# EAGLE design controller (EAGLE 6.5.0)
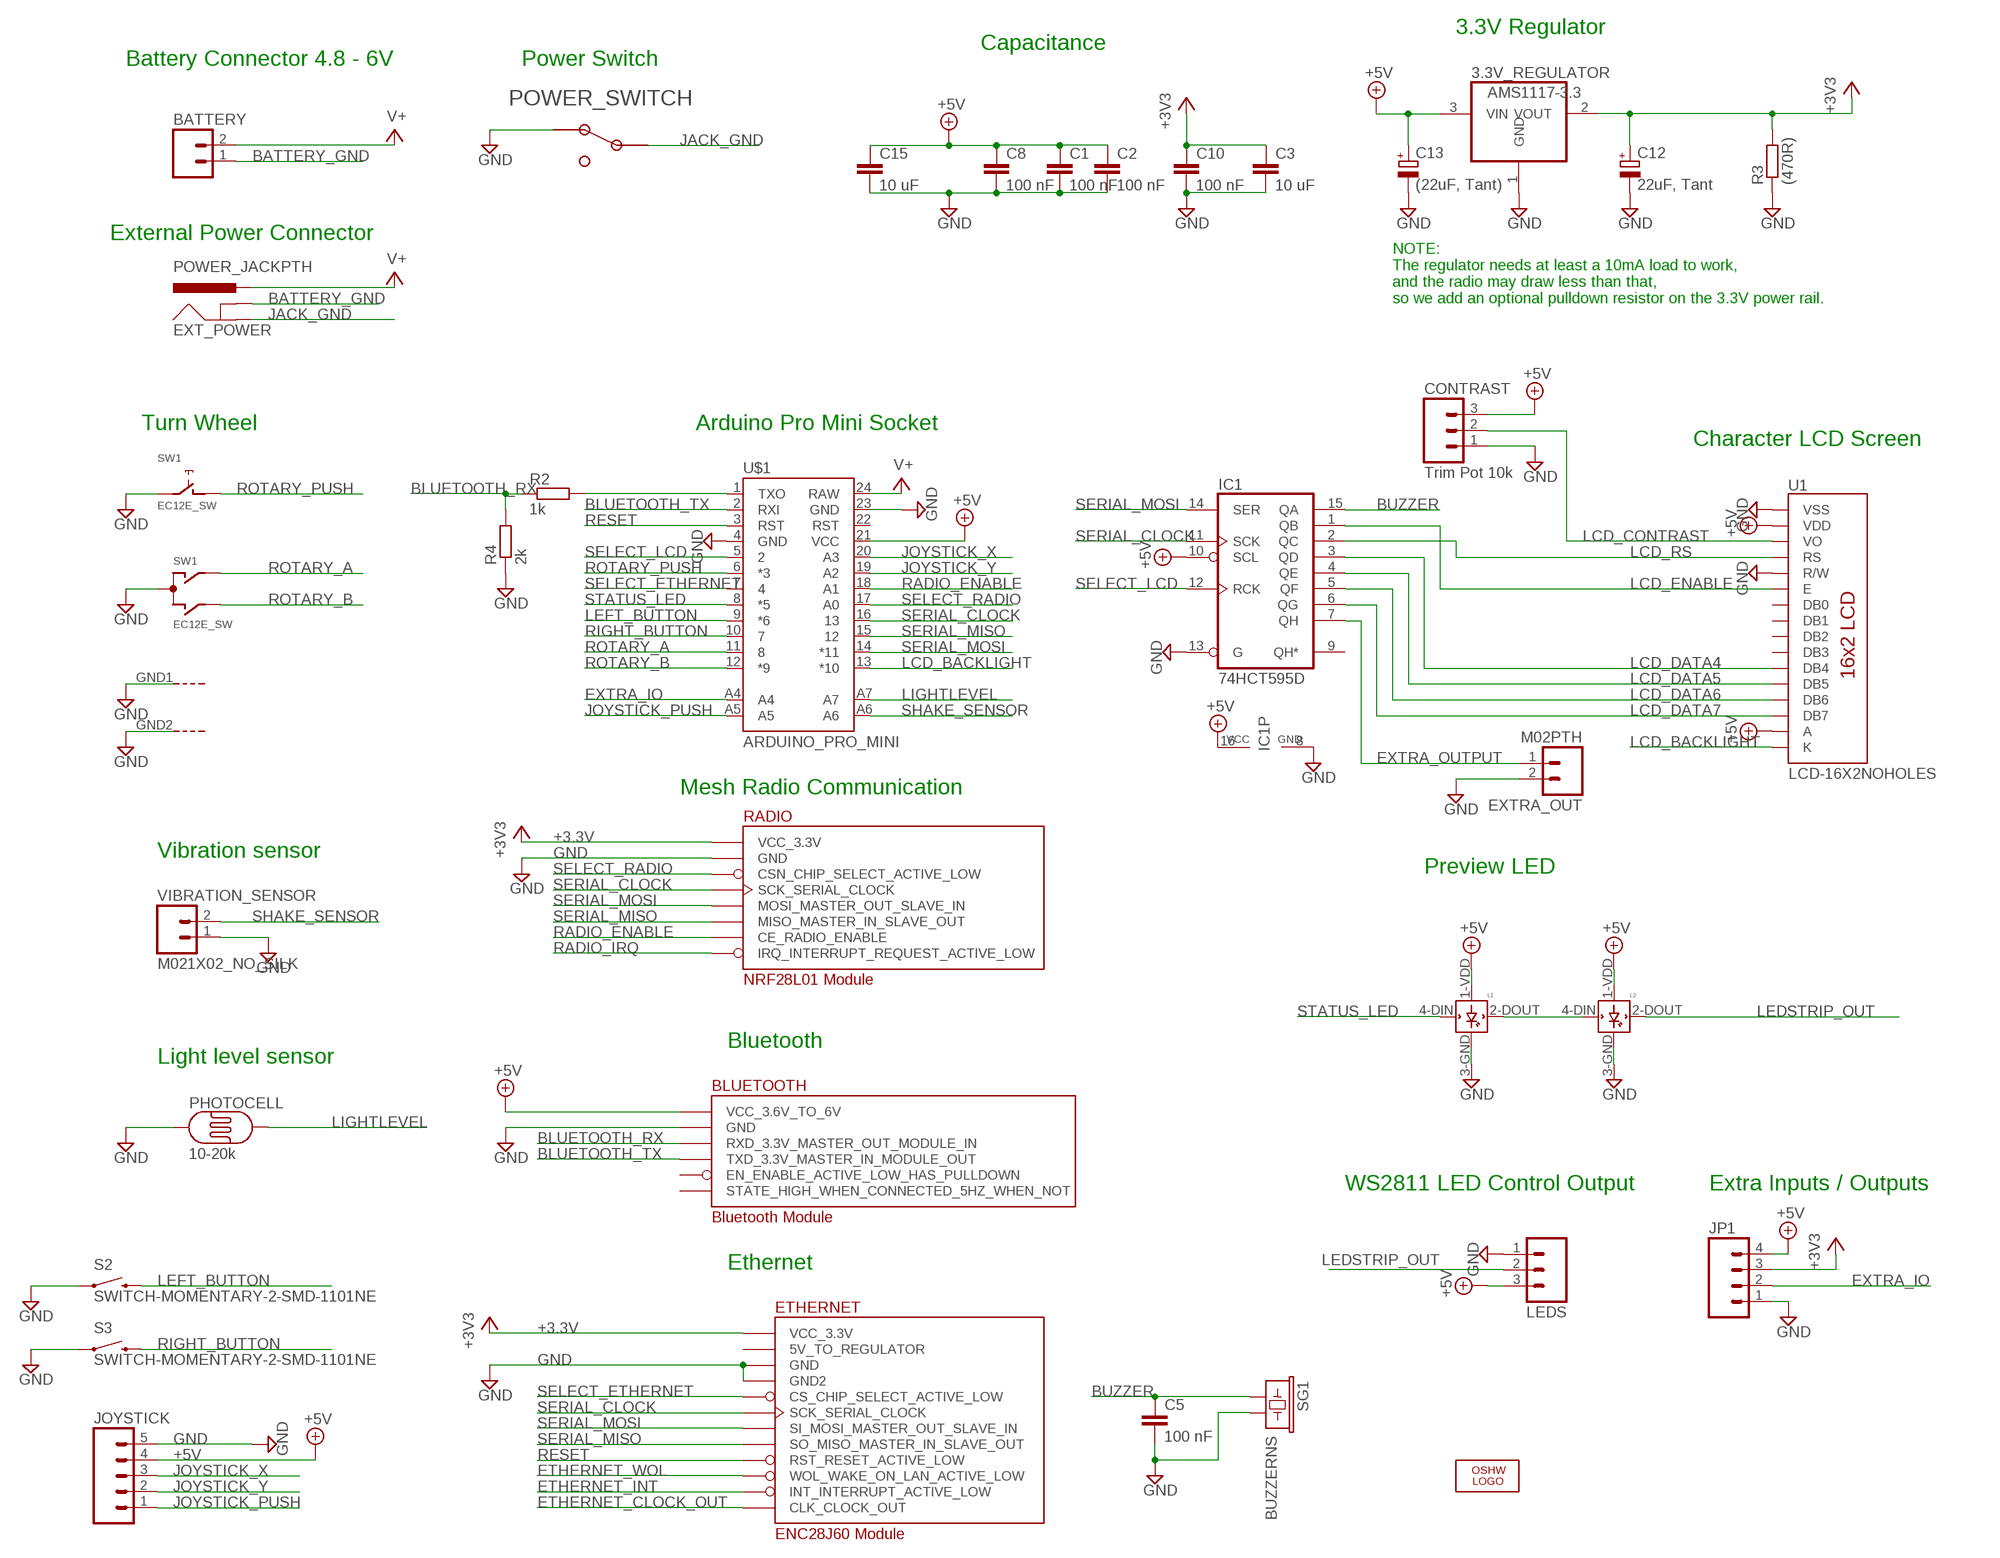
[diagram p0: schematic, sheet 1]

## Parts
3.3V_REGULATOR  AMS1117-3.3  REG1117  [SOT223]
BATTERY  M02LOCK_LONGPADS  [1X02_LOCK_LONGPADS]
BLUETOOTH  Bluetooth Module  BLUETOOTH_MODULE  [BLUETOOTH_MODULE]
C1  100 nF  C-EUC0805  [C0805]
C2  100 nF  C-EUC0805  [C0805]
C3  10 uF  C-EUC0805K  [C0805K]
C5  100 nF  C-EUC0805  [C0805]
C8  100 nF  C-EUC0805  [C0805]
C10  100 nF  C-EUC0805  [C0805]
C12  22uF, Tant  CPOL-EUSMCA  [SMC_A]
C13  (22uF, Tant)  CPOL-EUSMCA  [SMC_A]
C15  10 uF  C-EUC0805K  [C0805K]
CONTRAST  Trim Pot 10k  M031X03_NO_SILK  [1X03_NO_SILK]
ETHERNET  ENC28J60 Module  ETHERNET_ENC28J60_MODULE  [ETHERNET_ENC28J60_MODULE]
EXT_POWER  POWER_JACKPTH  [POWER_JACK_PTH]
EXTRA_OUT  M02PTH  [1X02]
IC1  74HCT595D  [SO16]
JOYSTICK  M05NO_SILK  [1X05_NO_SILK]
JP1  M041X04_NO_SILK  [1X04_NO_SILK]
L1  WS2812B  [WS2812B]
L2  WS2812B  [WS2812B]
LEDS  M03PTH  [1X03]
LOGO3  LOGO-OSHW-8MILX0100-NT  [OSHW_8X100_NOTEXT]
PHOTOCELL  10-20k  PHOTOCELLPTH  [PHOTOCELL]
POWER_SWITCH  KNC1-101-2P  [KNC1-101-2P]
R2  1k  R-EU_M0805  [M0805]
R3  (470R)  R-EU_M0805  [M0805]
R4  2k  R-EU_M0805  [M0805]
RADIO  NRF28L01 Module  NRF24L01_MODULE  [NRF24L01_MODULE]
S2  SWITCH-MOMENTARY-2-SMD-1101NE  [TACTILE-SWITCH-1101NE]
S3  SWITCH-MOMENTARY-2-SMD-1101NE  [TACTILE-SWITCH-1101NE]
SG1  BUZZERNS  [BUZZER-12MM-NS]
SW1  EC12E_SW  [ALPS_EC12E_SW]
U1  LCD-16X2NOHOLES  [LCD-16X2_NOHOLES]
U$1  ARDUINO_PRO_MINI  [ARDUINO_PRO_MINI]
VIBRATION_SENSOR  M021X02_NO_SILK  [1X02_NO_SILK]

## Nets
+3.3V: 3.3V_REGULATOR.2(VOUT) C3.1 C10.1 C12.+ ETHERNET.P$2(VCC_3.3V) JP1.3 R3.2 RADIO.P$2(VCC_3.3V) ; supply symbol labelled +3V3
+5V: 3.3V_REGULATOR.3(VIN) BLUETOOTH.P$5(VCC_3.6V_TO_6V) C1.1 C2.1 C8.1 C13.+ C15.1 CONTRAST.3 IC1.10(SCL) IC1.16(VCC) JOYSTICK.4 JP1.4 L1.1-VDD(VDD) L2.1-VDD(VDD) LEDS.3 U1.2(VDD) U1.15(A) U$1.21(VCC)
BATTERY_GND: BATTERY.1 EXT_POWER.GNDBREAK
BLUETOOTH_RX: BLUETOOTH.P$2(RXD_3.3V_MASTER_OUT_MODULE_IN) R2.1 R4.2
BLUETOOTH_TX: BLUETOOTH.P$3(TXD_3.3V_MASTER_IN_MODULE_OUT) U$1.2(RXI)
BUZZER: C5.1 IC1.15(QA) SG1.+
ETHERNET_CLOCK_OUT: ETHERNET.P$9(CLK_CLOCK_OUT)
ETHERNET_INT: ETHERNET.P$10(INT_INTERRUPT_ACTIVE_LOW)
ETHERNET_WOL: ETHERNET.P$7(WOL_WAKE_ON_LAN_ACTIVE_LOW)
EXTRA_IO: JP1.2 U$1.A4
EXTRA_OUTPUT: EXTRA_OUT.1 IC1.7(QH)
GND: 3.3V_REGULATOR.1(GND) BLUETOOTH.P$4(GND) C1.2 C2.2 C3.2 C5.2 C8.2 C10.2 C12.- C13.- C15.2 CONTRAST.1 ETHERNET.P$1(GND) ETHERNET.P$11(GND2) EXTRA_OUT.2 IC1.8(GND) IC1.13(G) JOYSTICK.5 JP1.1 L1.3-GND(GND) L2.3-GND(GND) LEDS.1 PHOTOCELL.1 POWER_SWITCH.P$1 R3.1 R4.1 RADIO.P$1(GND) S2.P$1 S3.P$1 SG1.- SW1.C SW1.E SW1.GND1(G) SW1.GND2(G) U1.1(VSS) U1.5(R/W) U$1.4(GND) U$1.23(GND) VIBRATION_SENSOR.1
JACK_GND: EXT_POWER.GND POWER_SWITCH.P$2
JOYSTICK_PUSH: JOYSTICK.1 U$1.A5
JOYSTICK_X: JOYSTICK.3 U$1.20(A3)
JOYSTICK_Y: JOYSTICK.2 U$1.19(A2)
LCD_BACKLIGHT: U1.16(K) U$1.13(*10)
LCD_CONTRAST: CONTRAST.2 U1.3(VO)
LCD_DATA4: IC1.3(QD) U1.11(DB4)
LCD_DATA5: IC1.4(QE) U1.12(DB5)
LCD_DATA6: IC1.5(QF) U1.13(DB6)
LCD_DATA7: IC1.6(QG) U1.14(DB7)
LCD_ENABLE: IC1.1(QB) U1.6(E)
LCD_RS: IC1.2(QC) U1.4(RS)
LEDSTRIP_OUT: L2.2-DOUT(DOUT) LEDS.2
LEFT_BUTTON: S2.P$2 U$1.9(*6)
LIGHTLEVEL: PHOTOCELL.2 U$1.A7
N$1: R2.2 U$1.1(TXO)
RADIO_ENABLE: RADIO.P$3(CE_RADIO_ENABLE) U$1.18(A1)
RADIO_IRQ: RADIO.P$8(IRQ_INTERRUPT_REQUEST_ACTIVE_LOW)
RESET: ETHERNET.P$4(RST_RESET_ACTIVE_LOW) U$1.3(RST)
RIGHT_BUTTON: S3.P$2 U$1.10
ROTARY_A: SW1.A U$1.11
ROTARY_B: SW1.B U$1.12(*9)
ROTARY_PUSH: SW1.D U$1.6(*3)
SELECT_ETHERNET: ETHERNET.P$3(CS_CHIP_SELECT_ACTIVE_LOW) U$1.7
SELECT_LCD: IC1.12(RCK) U$1.5
SELECT_RADIO: RADIO.P$4(CSN_CHIP_SELECT_ACTIVE_LOW) U$1.17(A0)
SERIAL_CLOCK: ETHERNET.P$6(SCK_SERIAL_CLOCK) IC1.11(SCK) RADIO.P$5(SCK_SERIAL_CLOCK) U$1.16
SERIAL_MISO: ETHERNET.P$8(SO_MISO_MASTER_IN_SLAVE_OUT) RADIO.P$7(MISO_MASTER_IN_SLAVE_OUT) U$1.15
SERIAL_MOSI: ETHERNET.P$5(SI_MOSI_MASTER_OUT_SLAVE_IN) IC1.14(SER) RADIO.P$6(MOSI_MASTER_OUT_SLAVE_IN) U$1.14(*11)
SHAKE_SENSOR: U$1.A6 VIBRATION_SENSOR.2
STATUS_LED: L1.4-DIN(DIN) U$1.8(*5)
STATUS_LED2: L1.2-DOUT(DOUT) L2.4-DIN(DIN)
V+: BATTERY.2 EXT_POWER.PWR U$1.24(RAW)
Unconnected: BLUETOOTH.P$1(STATE_HIGH_WHEN_CONNECTED_5HZ_WHEN_NOT) BLUETOOTH.P$6(EN_ENABLE_ACTIVE_LOW_HAS_PULLDOWN) ETHERNET.P$12(5V_TO_REGULATOR) IC1.9(QH*) U1.7(DB0) U1.8(DB1) U1.9(DB2) U1.10(DB3) U$1.22(RST)

## Notes on the sheet
- 3.3V Regulator
- Capacitance
- Battery Connector 4.8 - 6V | Power Switch
- External Power Connector
- NOTE:
  The regulator needs at least a 10mA load to work, 
  and the radio may draw less than that, 
  so we add an optional pulldown resistor on the 3.3V power rail.
- Turn Wheel | Arduino Pro Mini Socket
- Character LCD Screen
- Mesh Radio Communication
- Vibration sensor
- Preview LED
- Bluetooth
- Light level sensor
- WS2811 LED Control Output | Extra Inputs / Outputs
- Ethernet

## Library data of the parts
3.3V_REGULATOR = burr-brown:REG1117: 800mA and 1A Low Dropout (LDO) Positive Regulator 1.8V, 2.5V, 2.85V, 3.3V, 5V, and Adj; MPN: REG1117; OC_FARNELL: 1097566; OC_NEWARK: 14P6981
BATTERY = SparkFun:M02: Header 2 Standard 2-pin 0.1" header. Use with straight break away headers (SKU : PRT-00116), right angle break away headers (PRT-00553), swiss pins (PRT-00743), machine pins (PRT-00117), and female headers (PRT-00115). Molex polarized connector foot print use with SKU : PRT-08233 with associated crimp pins and housings.
BLUETOOTH = common_modules:BLUETOOTH_MODULE
C1-C3 C5 C8 C10 C15 = rcl:C-EU: CAPACITOR, European symbol
C12 C13 = rcl:CPOL-EU: POLARIZED CAPACITOR, European symbol
CONTRAST LEDS = SparkFun-Connectors:M03: Header 3 Standard 3-pin 0.1" header. Use with straight break away headers (SKU : PRT-00116), right angle break away headers (PRT-00553), swiss pins (PRT-00743), machine pins (PRT-00117), and female headers (PRT-00115). Molex polarized connector foot print use with SKU : PRT-08232 with associated crimp pins and housings.
ETHERNET = common_modules:ETHERNET_ENC28J60_MODULE
EXT_POWER = SparkFun-Connectors:POWER_JACK: Power Jack This is the standard 5.5mm barrel jack for power. The PTH is the most common, proven, reliable, footprint. The Slot footprint only works if the mill layer is transmitted to the PCB fab house so be warned. Mating wall wart : TOL-00298 (and others); PROD_ID: PRT-00119
EXTRA_OUT VIBRATION_SENSOR = SparkFun-Connectors:M02: Standard 2-pin 0.1" header. Use with - straight break away headers ( PRT-00116) - right angle break away headers (PRT-00553) - swiss pins (PRT-00743) - machine pins (PRT-00117) - female headers (PRT-00115) Molex polarized connector foot print use with: PRT-08233 with associated crimp pins and housings. 2.54_SCREWTERM for use with PRT-10571. 3.5mm Screw Terminal footprints for PRT-08084 5mm Screw Terminal footprints for use with PRT-08433
IC1 = 74xx-eu:74*595: 8-bit SHIFT REGISTER, output latch
JOYSTICK = SparkFun-Connectors:M05: Header 5 Standard 5-pin 0.1" header. Use with straight break away headers (SKU : PRT-00116), right angle break away headers (PRT-00553), swiss pins (PRT-00743), machine pins (PRT-00117), and female headers (PRT-00115). Molex polarized connector foot print use with SKU : PRT-08230 with associated crimp pins and housings.
JP1 = SparkFun-Connectors:M04: Header 4 Standard 4-pin 0.1" header. Use with straight break away headers (SKU : PRT-00116), right angle break away headers (PRT-00553), swiss pins (PRT-00743), machine pins (PRT-00117), and female headers (PRT-00115). Molex polarized connector foot print use with SKU : PRT-08231 with associated crimp pins and housings. 1MM SMD Version SKU: PRT-10208
L1 L2 = adafruit:WS2812B
LOGO3 = Logo:LOGO-OSHW-8MIL
PHOTOCELL = SparkFun-Sensors:PHOTOCELL: CdS photoresistor. This is a low cost way to detect light levels. Resistance decreases with more incoming light. SparkFun SKU: SEN-09088
POWER_SWITCH = knc1-101-switch:KNC1-101-2P
R2-R4 = rcl:R-EU_: RESISTOR, European symbol
RADIO = common_modules:NRF24L01_MODULE
S2 S3 = SparkFun-Electromechanical:SWITCH-MOMENTARY-2: Various NO switches- pushbuttons, reed, etc
SG1 = SparkFun-Electromechanical:BUZZER: Buzzer 12mm Spark Fun Electronics SKU : Comp-Buzzer
SW1 = switch-alps:EC12E_SW: ALPS rotary Encoder EC12E series with switch; MPN: EC12E2424407; OC_FARNELL: 1520813; OC_NEWARK: 74M1068
U1 = SparkFun:LCD-16X2
U$1 = SparkFun-Boards-with-arduino-pro-mini-without-connection-pins:ARDUINO_PRO_MINI

## Board
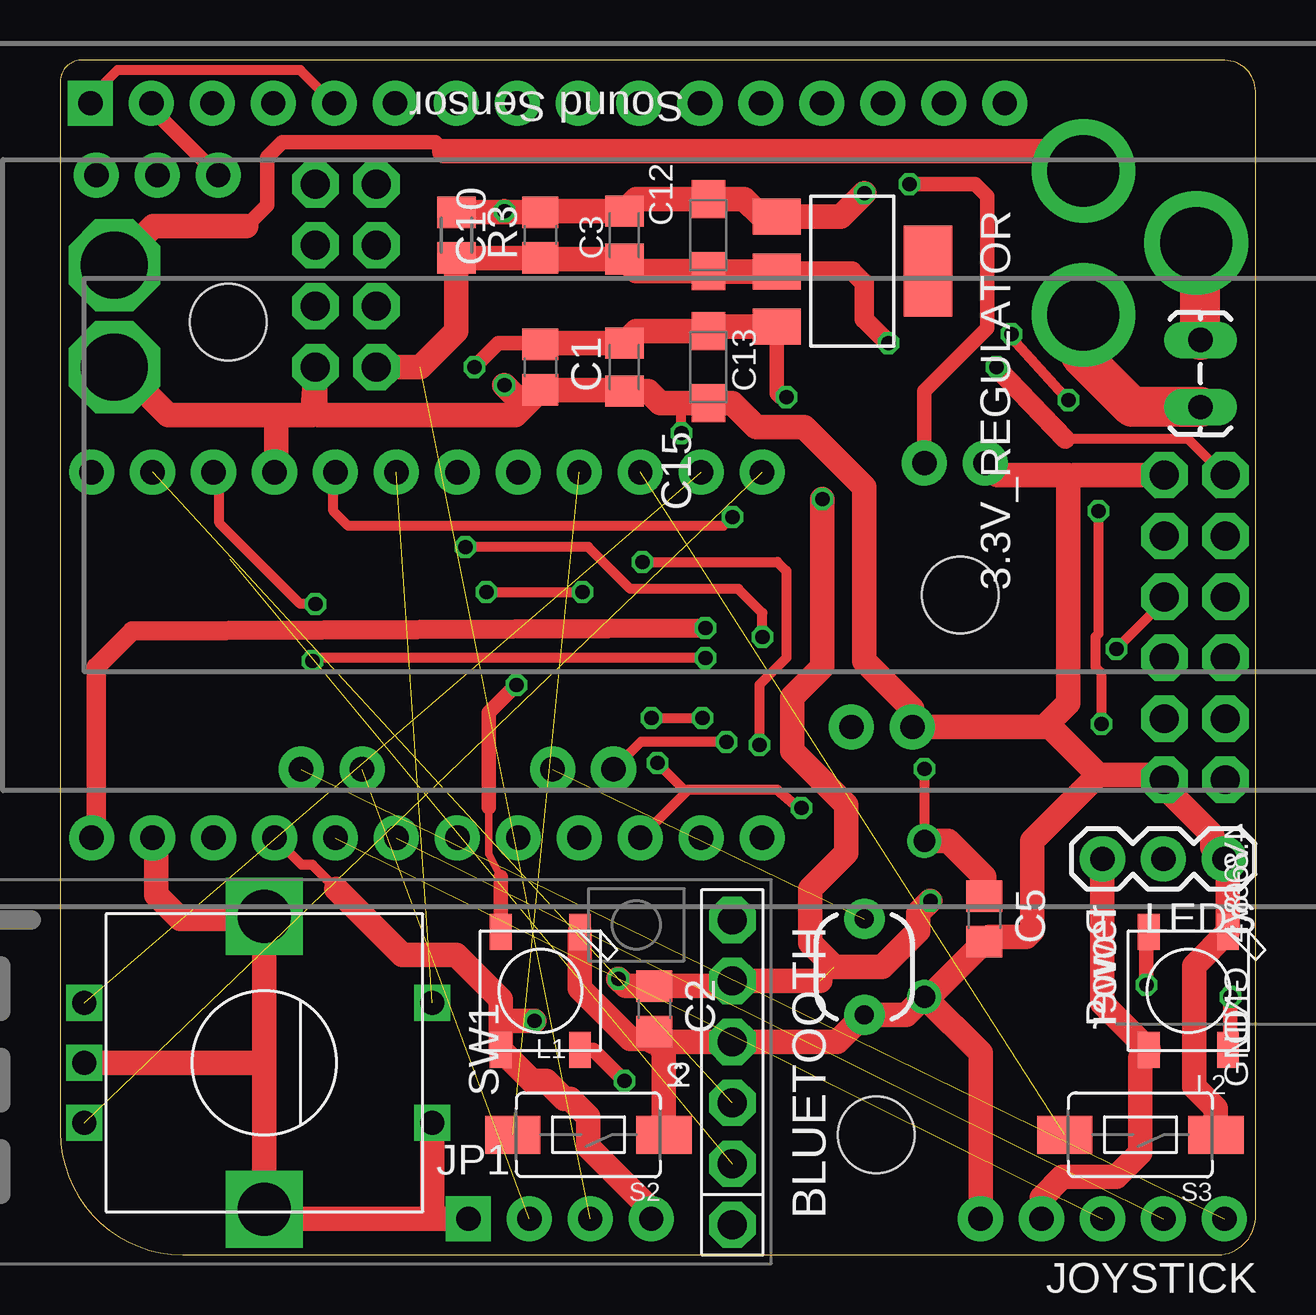
[diagram p1: board, top side]
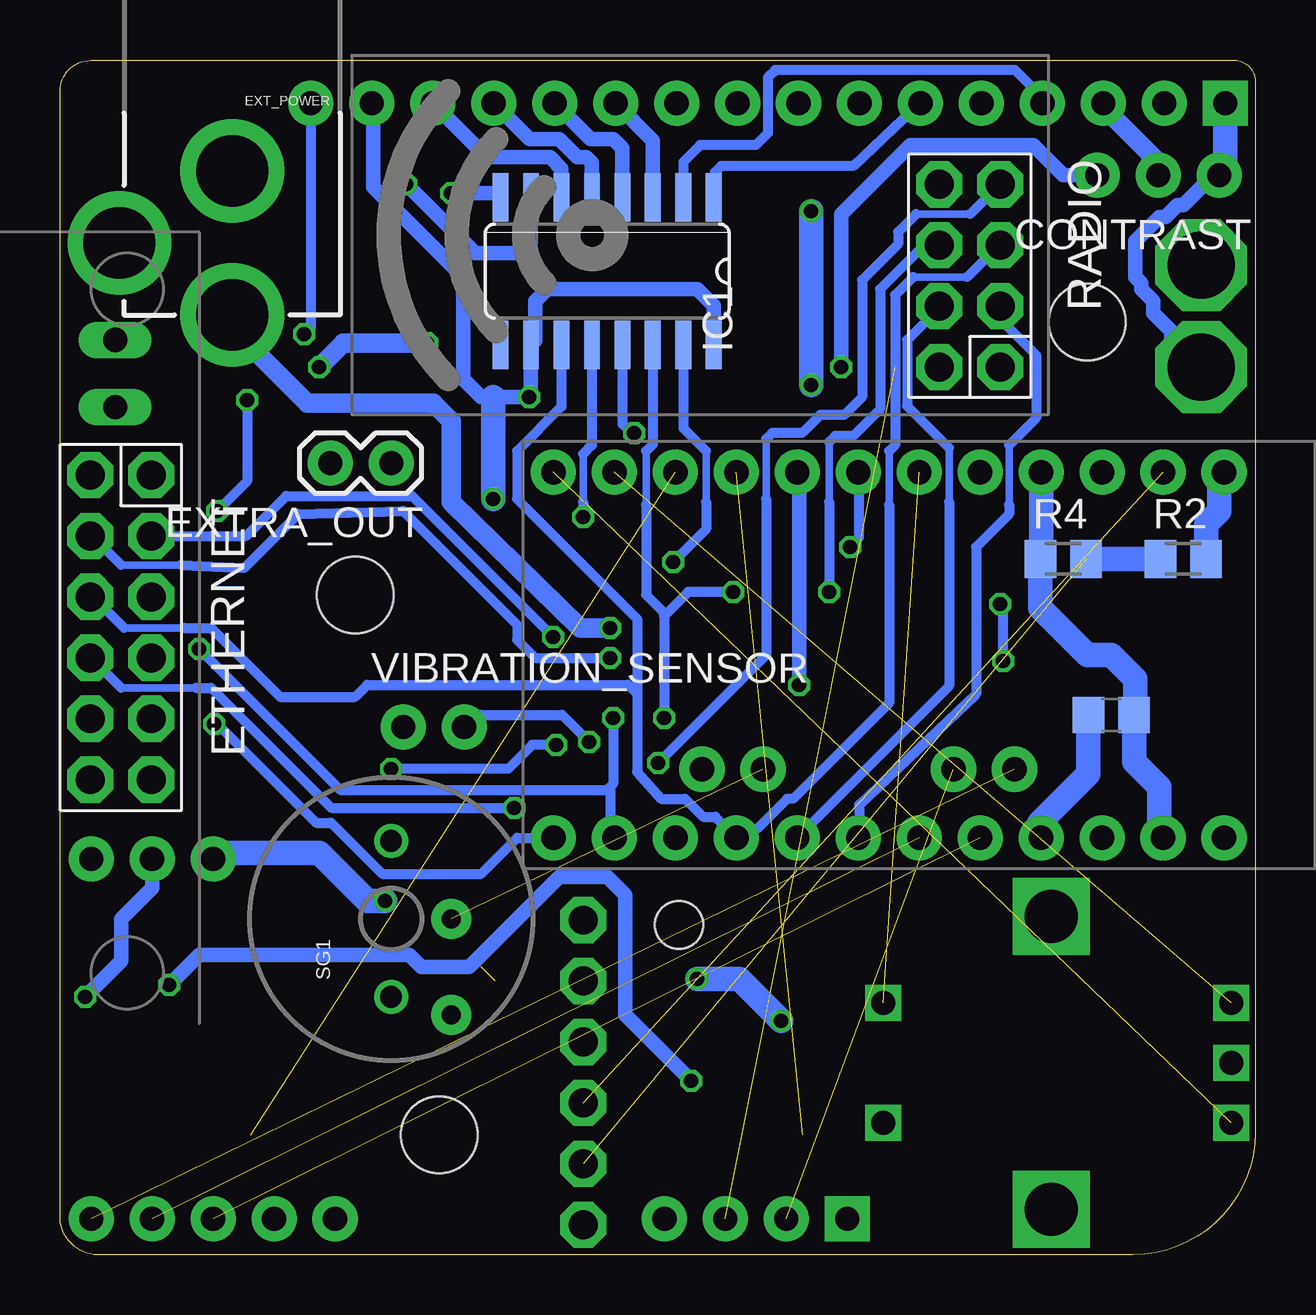
[diagram p2: board, bottom side, seen from below]

Size 49.8 x 49.8 mm. Coordinates in mm from the lower left corner, seen from the top.
Outline: 49.8,1.5 49.8,48.5 arc90 48.52,49.79 1.01,49.8 arc90 0,48.99 0,5.1 arc90 5.1,0 48.1,0 arc90 49.8,1.5
Copper layers (1*16): Top 0.035mm / dielectric 1.5mm / Bottom 0.035mm
Design rules "SeeedStudio_2layer_DRU_no_angle_20140221": minimum track width 6mil, minimum drill 12mil, track to track 6mil, track to pad 6mil, pad to pad 6mil, via to via 6mil, smd to smd 0mil, copper to edge 10mil, drill to drill 10mil, minimum pad ring 10mil, minimum via ring 6mil, stop-mask expansion 2mil, vias tented up to drill 100mil, thermal gap 10mil
Holes 3.2 mm at 37.5,27.5 7,38.88 34,5
Holes 2 mm at 24,13.75
tRestrict: area 32,3 to 36,7; area 35.5,25.5 to 39.5,29.5; area 6,37.9 to 8,39.9
bRestrict: area 32,3 to 36,7; area 35.5,25.5 to 39.5,29.5; area 6,37.9 to 8,39.9

### Footprints (pad centres in the part's own frame; a part is rotated, then mirrored left to right if it is on the bottom)
SOT223 = smd 1.499 x 2.007: 1 -2.261,-3.15; 2 0.025,-3.15; 3 2.311,-3.15 | smd 3.81 x 2.007: 4 0,3.15
1X02_LOCK_LONGPADS = drill 1.016 long: 1 -0.127,0; 2 2.667,0
BLUETOOTH_MODULE = drill 1.2 pad 1.93 octagon: P$1 0,0; P$2 2.54,0; P$3 5.08,0; P$4 7.62,0; P$5 10.16,0; P$6 12.7,0
C0805 = smd 1.3 x 1.5: 1 -0.95,0; 2 0.95,0
C0805K = smd 1.3 x 1.6: 1 -1,0; 2 1,0
SMC_A = smd 1.6 x 1.4: + -1.5,0; - 1.5,0
1X03_NO_SILK = drill 1.016 pad 1.88: 1 0,0; 2 2.54,0; 3 5.08,0
ETHERNET_ENC28J60_MODULE = drill 1.2 pad 1.93 octagon: P$1 0,0; P$2 0,2.54; P$3 2.54,0; P$4 2.54,2.54; P$5 5.08,0; P$6 5.08,2.54; P$7 7.62,0; P$8 7.62,2.54; P$9 10.16,0; P$10 10.16,2.54; P$11 12.7,0; P$12 12.7,2.54
POWER_JACK_PTH = drill 2.997 pad 4.318: GND 0,7.7; GNDBREAK 4.7,10.7; PWR 0,13.7
1X02 = drill 1.016 pad 1.88: 1 0,0; 2 2.54,0
SO16 = smd 0.66 x 2.032: 1 -4.445,-3.073; 2 -3.175,-3.073; 3 -1.905,-3.073; 4 -0.635,-3.073; 5 0.635,-3.073; 6 1.905,-3.073; 7 3.175,-3.073; 8 4.445,-3.073; 9 4.445,3.073; 10 3.175,3.073; 11 1.905,3.073; 12 0.635,3.073; 13 -0.635,3.073; 14 -1.905,3.073; 15 -3.175,3.073; 16 -4.445,3.073
1X05_NO_SILK = drill 1.016 pad 1.88: 1 0,0; 2 2.54,0; 3 5.08,0; 4 7.62,0; 5 10.16,0
1X04_NO_SILK = drill 1.016 pad 1.88 square: 1 0,0 | drill 1.016 pad 1.88: 2 2.54,0; 3 5.08,0; 4 7.62,0
WS2812B = smd 1.5 x 0.9: 1-VDD 2.45,-1.65; 2-DOUT 2.45,1.65; 3-GND -2.45,1.65; 4-DIN -2.45,-1.65
1X03 = drill 1.016 pad 1.88: 1 0,0; 2 2.54,0; 3 5.08,0
PHOTOCELL = drill 0.8 pad 1.676: 1 -2,0; 2 2,0
KNC1-101-2P = drill 2.8 pad 3.81 octagon: P$1 0,-2; P$2 0,2.25
M0805 = smd 1.3 x 1.6: 1 -0.95,0; 2 0.95,0
NRF24L01_MODULE = drill 1.2 pad 1.93 octagon: P$1 0,0; P$2 0,2.54; P$3 2.54,0; P$4 2.54,2.54; P$5 5.08,0; P$6 5.08,2.54; P$7 7.62,0; P$8 7.62,2.54
TACTILE-SWITCH-1101NE = smd 2.3 x 1.6: P$1 -3.15,0; P$2 3.15,0
BUZZER-12MM-NS = drill 0.9: + 3.25,0; - -3.25,0
ALPS_EC12E_SW = drill 1 square: A -2.5,-7.5; B 2.5,-7.5; C 0,-7.5; D -2.5,7; E 2.5,7 | drill 2.2 square: GND1 -6.1,0; GND2 6.1,0
LCD-16X2_NOHOLES = drill 1.016 pad 1.88 square: 1 -32,15.5 | drill 1.016 pad 1.88: 2 -29.46,15.5; 3 -26.92,15.5; 4 -24.38,15.5; 5 -21.84,15.5; 6 -19.3,15.5; 7 -16.76,15.5; 8 -14.22,15.5; 9 -11.68,15.5; 10 -9.14,15.5; 11 -6.6,15.5; 12 -4.06,15.5; 13 -1.52,15.5; 14 1.02,15.5; 15 3.56,15.5; 16 6.1,15.5
ARDUINO_PRO_MINI = drill 1.016 pad 1.88: 1 -7.62,12.7; 2 -7.62,10.16; 3 -7.62,7.62; 4 -7.62,5.08; 5 -7.62,2.54; 6 -7.62,0; 7 -7.62,-2.54; 8 -7.62,-5.08; 9 -7.62,-7.62; 10 -7.62,-10.16; 11 -7.62,-12.7; 12 -7.62,-15.24; 13 7.62,-15.24; 14 7.62,-12.7; 15 7.62,-10.16; 16 7.62,-7.62; 17 7.62,-5.08; 18 7.62,-2.54; 19 7.62,0; 20 7.62,2.54; 21 7.62,5.08; 22 7.62,7.62; 23 7.62,10.16; 24 7.62,12.7; A4 4.763,1.429; A5 4.763,3.969; A6 4.763,-9.049; A7 4.763,-6.509
1X02_NO_SILK = drill 1.016 pad 1.88: 1 0,0; 2 2.54,0

### Placement (x,y rotation side)
3.3V_REGULATOR  33,41 270 top
BATTERY  47.5,38 270 top
BLUETOOTH  28,1.25 90 top
C1  20,37 270 top
C2  24.75,10.25 270 top
C3  23.5,42.5 90 top
C5  38.5,14 270 top
C8  6,22.5 0 bottom
C10  20,42.5 90 top
C12  27,42.5 90 top
C13  27,37 270 top
C15  23.5,37 270 top
CONTRAST  1.5,45 180 bottom
ETHERNET  46,32.5 270 top
EXT_POWER  42.62,52.88 180 bottom
EXTRA_OUT  36,33 180 bottom
IC1  27,41 180 bottom
JOYSTICK  48.5,1.5 180 top
JP1  17,1.5 0 top
L1  20,11 270 top
L2  47,11 270 top
LEDS  48.5,16.5 180 top
LOGO3  85.5,46 0 bottom  (outside the outline)
PHOTOCELL  33.5,12 90 top
POWER_SWITCH  2.25,39 0 top
R2  3,29 0 bottom
R3  16.5,42.5 270 top
R4  8,29 0 bottom
RADIO  10.62,37 90 bottom
S2  22,5 180 top
S3  45,5 180 top
SG1  36,14 90 bottom
SW1  8.5,8 270 top
U1  33.25,32.5 0 top
U$1  14,25 270 bottom
VIBRATION_SENSOR  35.5,22 0 bottom

### Tracks (layer width: path | path; a pad name or v marks a point on that pad's centre or on a via)
+3.3V  (via drill 0.6)  (1 unrouted)
  Top 0.406: ETHERNET.P$2 48.5,32.5 47,34 41.88,34
  Top 0.813: 41.88,34 v39,37 | v34.5,38 33.5,39 33.5,40.5 33,41 29.88,41 3.3V_REGULATOR.2
  Top 1.016: 3.3V_REGULATOR.2 27.02,40.98 C12.+ 24,41 C3.1 20.05,41.5 C10.1 R3.2 16.5,38.5 15,37 RADIO.P$2
  Bottom 0.813: v39,37 38,38 v34.5,38
+5V  (via drill 0.6)  (1 unrouted)
  Top 0.406: 11.5,15.25 10.5,16.25 10.05,16.25 U$1.21
  Top 0.61: 3.3V_REGULATOR.3 29.85,35.9 30,35.75 v30.25,35.75 | U1.2 3.79,47.79 CONTRAST.3 | v17.25,37 18.25,38 19.95,38 C1.1
  Top 1.016: 3.3V_REGULATOR.3 27.19,38.69 C13.+ 24,38.5 C15.1 20.05,38 C1.1 | LEDS.3 43.42,10.48 L2.1-VDD 45,8.2 45,4.25 44,3.25 41.75,3.25 40.88,2.38 JOYSTICK.4 | JP1.4 24.62,1.88 22,4.5 22,5.75 21.25,6.5 21,6.5 20.25,7.25 19.65,7.25 L1.1-VDD 18.35,10 | 18.35,10 18.35,10.65 16.5,12.5 14.25,12.5 11.5,15.25 | v23.25,11.5 23.55,11.2 C2.1 27.79,11.2 BLUETOOTH.P$5 31.66,11.41 | v19.75,9.75 18.6,9.75 18.35,10 | v36.25,14.75 35.75,14.25 35.75,13.5 34.25,12 32.25,12 31.25,13 31.25,15.25 32.75,16.75 32.75,18.75 30.5,21 30.5,23.25 31.75,24.5 v31.75,31.5
  Bottom 0.61: U1.15 36.75,47.94 36.75,44.5 33,40.75 33,36.5 32.25,35.75 31.75,35.75 v30.25,35.75 30.18,35.58 IC1.10 30,38.1 30,39.75 29.5,40.25 23.25,40.25 22.55,39.56 IC1.16 | CONTRAST.3 8,45 9.25,46.25 14.38,46.25 17.25,43.38 v17.25,37
  Bottom 1.016: C8.1 6.95,20.05 9,18 9,17.46 U$1.21 | v23.25,11.5 21.5,11.5 v19.75,9.75 | v36.25,14.75 37,14.75 39,16.75 43.17,16.75 LEDS.3 | v31.75,31.5 31.75,35.75
BATTERY_GND
  Top 1.676: BATTERY.1 47.5,42 EXT_POWER.GNDBREAK
BLUETOOTH_RX  (1 unrouted)
  Bottom 1.016: R2.1 R4.2
BLUETOOTH_TX  (1 unrouted)
BUZZER  (via drill 0.6)
  Top 0.406: v24.25,28.88 29.88,28.88 30.25,28.5 30.25,24.88 29.12,23.75 v29.12,21.25 | v36,20.25 SG1.+
  Top 1.016: SG1.+ 37,17.25 38.5,15.75 C5.1
  Bottom 0.305: 22.88,33.5 22.88,31.38
  Bottom 0.406: IC1.15 23.82,34.45 22.88,33.5 | 22.88,31.38 22.88,30.25 v24.25,28.88 | v29.12,21.25 30.12,21.25 31.12,20.25 v36,20.25
EXTRA_IO  (1 unrouted)
EXTRA_OUTPUT  (via drill 0.6)
  Top 0.61: v35.38,44.63 38.12,44.63 38.62,44.13 38.62,38.63 36,36 EXTRA_OUT.1
  Bottom 0.61: IC1.7 30.18,42.2 30.62,41.75 32.5,41.75 v35.38,44.63
GND  (via drill 0.6)
  Top 0.406: U1.5 11.38,48 10,49.38 2.38,49.38 1.88,48.88 1.88,48.63 U1.1 | v25.88,34.25 25.88,35.5
  Top 1.016: POWER_SWITCH.P$1 2.5,37 4.5,35 9,35 | 9,35 10.5,35 10.62,36.63 | 9,35 9,32.7 U$1.4 | v33.5,44.25 32.51,43.26 3.3V_REGULATOR.1 29.24,43.26 28.5,44 C12.- 24,44 C3.2 20.05,43.5 C10.2 18.55,43.45 v18.5,43.5 18.45,43.45 R3.1 | RADIO.P$1 10.62,36.63 | 10.62,36.63 10.62,35.13 10.75,35 18.95,35 19.35,35.4 | 19.35,35.4 C1.2 23.45,36.05 C15.2 24.5,36 25,35.5 25.88,35.5 C13.- 28,35.5 29,34.5 31,34.5 33.5,32 33.5,24.75 35.5,22.75 VIBRATION_SENSOR.1 41,22 | 41,22 41.25,22 43.25,20 | 43.25,20 45.8,20 ETHERNET.P$11 46,19.5 48,17.5 48,17 LEDS.1 48.65,16.35 L2.3-GND 47.25,12.05 47.25,7 48.15,6.1 S3.P$1 | EXTRA_OUT.2 39.04,32.5 42,32.5 42,32.25 | 42,32.25 42,23 41,22 | ETHERNET.P$1 42.25,32.5 42,32.25 | 43.25,20 40.5,17.25 40.5,13.5 40.25,13.25 38.7,13.25 C5.2 36.2,10.75 SG1.- | C2.2 24.68,8.87 BLUETOOTH.P$4 32.37,8.87 PHOTOCELL.1 35.25,10 SG1.- | S2.P$1 25.15,8.4 C2.2 | L1.3-GND 21.65,11.1 23.75,9 24.45,9 C2.2 | JP1.1 15.5,1.5 | 15.5,1.5 8.9,1.5 SW1.GND2 8.5,7.75 | 8.5,7.75 SW1.GND1 8.4,14 5,14 4,15 v4,17.54 | SW1.C 8.25,8 8.5,7.75 | SW1.E 15.5,1.5 | JOYSTICK.5 38.34,8.41 SG1.- | v18.5,36.25 19.35,35.4
  Bottom 0.406: IC1.13 26.36,34.62 v25.88,34.25
  Bottom 0.61: v33.5,44.25 31.62,44.25 IC1.8 | CONTRAST.1 1.75,45 3,43.75 3.25,43.75 3.75,43.25 4,43.25 5,42.25 5,40.75 4.75,40.5 4.75,40.25 4.25,39.75 4.25,39.25 3.5,38.5 3.5,38.25 POWER_SWITCH.P$1
  Bottom 1.016: U$1.4 8.92,29.03 R4.1 8.95,26.95 7,25 6,25 5,24 5,22.55 C8.2 5.05,20.55 4,19.5 v4,17.54 U$1.23 | U1.1 1.25,45.25 CONTRAST.1 | v18.5,43.5 v18.5,36.25
JACK_GND
  Top 0.61: 16,46 15.62,46.38 9.25,46.38 8.62,45.75 8.62,43.75 7.75,42.88
  Top 1.016: EXT_POWER.GND 42.33,45.18 41.5,46 16,46 | 7.75,42.88 3.88,42.88 POWER_SWITCH.P$2
JOYSTICK_PUSH  (1 unrouted)
JOYSTICK_X  (1 unrouted)
JOYSTICK_Y  (1 unrouted)
LCD_BACKLIGHT  (via drill 0.6)
  Top 0.406: v39.62,38.38 39.62,38.25 v42,35.63 | v43.25,31 43.25,25.88 43.12,25.75 43.12,24.5 43.38,24.25 v43.38,22.13
  Bottom 0.406: U1.16 39.35,38.65 v39.62,38.38 | v42,35.63 42,32.25 v43.25,31 | v43.38,22.13 43.25,22.13 39.12,18 38.5,18 36.38,15.88 32.25,15.88 30.75,17.38 U$1.13
LCD_CONTRAST
  Bottom 0.813: U1.3 6.33,47.83 4.12,45.63 4.12,45.09 CONTRAST.2
LCD_DATA4
  Bottom 0.61: U1.11 25.09,46.45 IC1.3
LCD_DATA5
  Bottom 0.61: U1.12 27.69,46.5 26.75,46.5 26.36,46.12 IC1.4
LCD_DATA6
  Bottom 0.61: U1.13 30.23,46.5 29,46.5 28.25,45.75 27.88,45.75 27.64,45.51 IC1.5
LCD_DATA7
  Bottom 0.61: U1.14 32.02,45.75 29.38,45.75 28.91,45.28 IC1.6
LCD_ENABLE
  Bottom 0.406: U1.6 14.25,47.75 16.75,45.38 22.25,45.38 22.5,45.13 22.5,44.75 22.55,44.7 IC1.1
LCD_RS
  Bottom 0.406: U1.4 8.87,48.25 10,49.38 20,49.38 20.3,49.08 20.3,46.75 20.8,46.25 23.12,46.25 23.82,45.55 IC1.2
LEDSTRIP_OUT  (via drill 0.6)
  Top 0.61: v48.75,10.75 48.75,8.65 L2.2-DOUT
  Bottom 0.61: LEDS.2 45.96,15.29 47.25,14 47.25,12.25 v48.75,10.75
LEFT_BUTTON  (1 unrouted)
LIGHTLEVEL  (1 unrouted)
N$1
  Bottom 1.016: R2.2 2.05,30.45 1.5,31 1.5,32.42 U$1.1
RADIO_ENABLE
  Bottom 0.305: 10.25,33.75 10.25,31.25
  Bottom 0.406: RADIO.P$3 10.62,39 9.12,37.5 9.12,34.88 10.25,33.75 | 10.25,31.25 10.25,30.88 11.62,29.5 11.62,23.38 16.5,18.75 16.5,17.42 U$1.18
RESET  (via drill 0.6)
  Top 0.406: v26.88,24.88 10.62,24.88 v10.5,24.75 | v10.62,27.13 10,27.13 6.62,30.5 6.62,32.38 U$1.3
  Bottom 0.305: 47.25,28.75 44.75,28.75
  Bottom 0.406: ETHERNET.P$4 48.46,29.96 47.25,28.75 | 44.75,28.75 42.12,28.63 39.88,30.88 35.5,31 30.75,26.25 30.75,25.63 30,24.88 v26.88,24.88 | v10.5,24.75 10.5,26.88 v10.62,27.13
RIGHT_BUTTON  (1 unrouted)
ROTARY_A  (1 unrouted)
ROTARY_B  (1 unrouted)
ROTARY_PUSH  (1 unrouted)
SELECT_ETHERNET  (via drill 0.6)
  Top 0.406: v29.25,25.75 29.25,26.75 28.25,27.75 23.75,27.75 22,29.5 v16.88,29.5
  Bottom 0.406: ETHERNET.P$3 42.04,29.96 40.38,31.63 35.12,31.63 v29.25,25.75 | v16.88,29.5 16.5,29.91 16.5,32.5 16.62,32.63 U$1.7
SELECT_LCD  (via drill 0.6)
  Top 0.406: v28,30.75 27.62,30.38 12,30.38 11.38,31 11.38,32.54 U$1.5
  Bottom 0.305: 28,33.38 28,31.38
  Bottom 0.406: IC1.12 27.64,33.74 28,33.38 | 28,31.38 v28,30.75
SELECT_RADIO
  Bottom 0.305: 12.75,33.63 12.75,31.38
  Bottom 0.406: RADIO.P$4 13.16,39.46 14.5,38.13 14.5,35.38 12.75,33.63 | 12.75,31.38 12.75,23.71 U$1.17
SERIAL_CLOCK
  Bottom 0.305: 12,40.75 14.25,40.75 | 15.25,33.5 15.25,31.25 | 47.12,26.13 44.62,26.13
  Bottom 0.406: IC1.11 28.91,35.35 30.75,33.5 30.75,31.5 25.75,26.5 25.75,23.38 | 25.75,23.38 25.75,20.13 24.75,19 23.75,19 23,18.25 22.49,18.25 U$1.16 21.25,17.75 20.75,17.75 19.5,19 19.25,19 15.25,23 15.25,31.25 | RADIO.P$5 10.67,42.08 12,40.75 | 14.25,40.75 15,40 15,33.75 15.25,33.5 | ETHERNET.P$6 48.42,27.42 47.12,26.13 | 44.62,26.13 43.5,26.13 40.62,23.25 37.5,23.25 37,23.75 26.12,23.75 25.75,23.38
SERIAL_MISO  (via drill 0.6)
  Top 0.406: v30.88,18.63 30.75,18.63 29.88,19.38 26.16,19.38 26.14,19.36 | 26.14,19.36 U$1.15 | v24.88,20.5 26,19.38 26.14,19.36
  Bottom 0.305: 47.25,23.63 44.12,23.63 | 11.88,43.38 14.12,43.38 | 20.38,34 20.38,31.5
  Bottom 0.406: ETHERNET.P$8 48.51,24.88 47.25,23.63 | 44.12,23.63 43.5,23.63 38.5,18.63 v30.88,18.63 | RADIO.P$7 11.88,43.38 | 14.12,43.38 14.88,42.63 14.88,42.13 16.38,40.63 16.38,35.75 17.12,35 18.12,35 18.88,34.25 20.12,34.25 20.38,34 | 20.38,31.5 20.38,25 v24.88,20.5
SERIAL_MOSI  (via drill 0.6)
  Top 0.406: ETHERNET.P$5 46,27.25 v44,25.25 | v24.62,22.38 v26.75,22.38 | v17.75,27.63 v21.75,27.63
  Bottom 0.305: 25.38,33.5 25.38,31.25 | 17.75,33.88 17.75,31.38
  Bottom 0.406: v44,25.25 38.12,19.38 27,19.38 | 27,19.38 26.88,19.38 26.88,17.56 U$1.14 | IC1.14 25.09,33.78 25.38,33.5 | 25.38,31.25 25.38,27.5 24.62,26.75 24.62,26.63 | 24.62,26.63 v24.62,22.38 | v26.75,22.38 26.75,19.63 27,19.38 | RADIO.P$6 13.79,42.08 15.62,40.25 15.62,35.25 16.75,34.13 17.5,34.13 17.75,33.88 | 17.75,31.38 v17.75,27.63 | v21.75,27.63 23.62,27.63 24.62,26.63
SHAKE_SENSOR  (via drill 0.6)
  Top 0.406: v27.75,21.38 24.19,21.38 U$1.A6
  Bottom 0.406: VIBRATION_SENSOR.2 32.75,22 32.25,22.5 28.88,22.5 v27.75,21.38
STATUS_LED  (via drill 0.6)
  Top 0.305: 18.35,15.75 17.85,16.7 17.85,18.65
  Top 0.61: L1.4-DIN 18.35,15.75 | 17.85,18.65 17.85,22.6 v19,23.75
  Bottom 0.61: v19,23.75 19,32.54 U$1.8
STATUS_LED2  (via drill 0.6)
  Top 0.61: L1.2-DOUT 22.2,8.55 v23.5,7.25 | v45.25,11.25 45.25,13.35 L2.4-DIN
  Bottom 0.61: v23.5,7.25 26.25,10 26.25,15 27,15.75 29,15.75 32.75,12 34.75,12 35.25,12.5 44,12.5 v45.25,11.25
V+  (via drill 0.6)
  Top 0.813: v26.88,26.13 3,26 1.5,24.5 1.5,17.58 U$1.24
  Top 1.676: BATTERY.2 44.67,35.34 42.5,37.5 42.5,39.05 EXT_POWER.PWR
  Bottom 0.813: EXT_POWER.PWR 42.62,38.63 39.5,35.5 34.25,35.5 33.5,34.75 33.5,31.38 28.12,26.13 v26.88,26.13

### Text on the board
tValues: +3.3V | 10k | WS2812B
bValues: +3.3V | + | LED
tSilk: Sound Sensor | +5V | Arduino Pro Mini | +5V | IO | 4.8-6V | WS2811 | Extra IO | 1 | Power | 4.8-6V | GND | GND | IO | Power | +5V | WS2811 | GND | 1 | GND | 2 | 2 | 2 | GND | DO | Extra IO | DO | +5V | GND
_bsilk: LedController v0.3 | github.com/zzorn/ledmess